# EAGLE design MWElement5x15 (EAGLE 8.6.0)
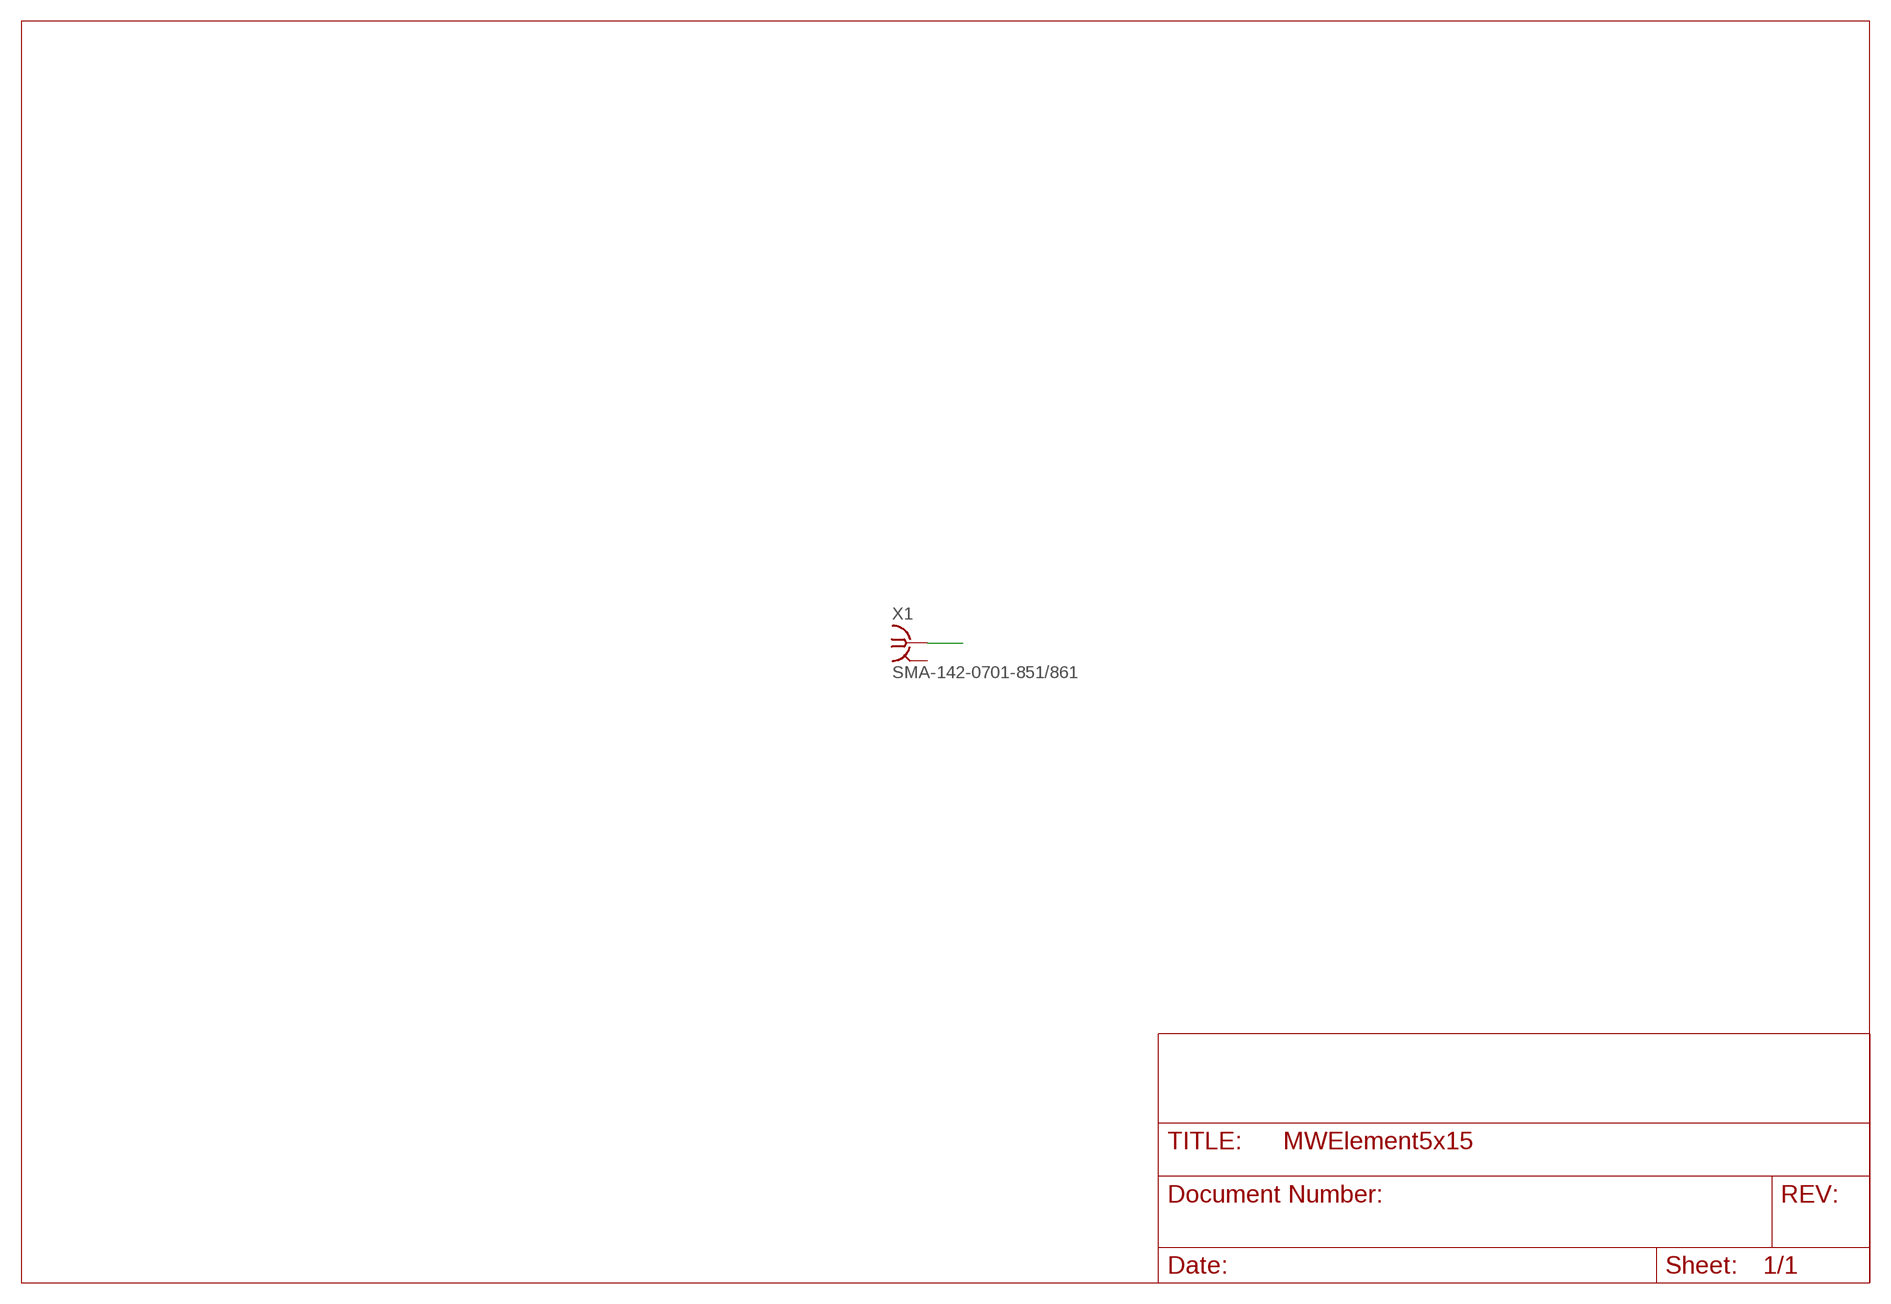
[diagram p0: schematic, sheet 1]

## Parts
X1  SMA-142-0701-851/861  [J502-ND-142-0701-851/861]

## Nets
P: X1.1
Unconnected: X1.G@1 X1.G@2 X1.G@3 X1.G@4

## Library data of the parts
X1 = con-coax:SMA-: SMA 50 Ohm End Launch Jack Receptacle - Round Contact Johnson Components Source: www.johnsoncomponents.com .. J502-ND.pdf; MF: JOHNSON COMPONENTS; MPN: 142-0701-851; OC_FARNELL: 1019325; OC_NEWARK: 99F6798

## Board
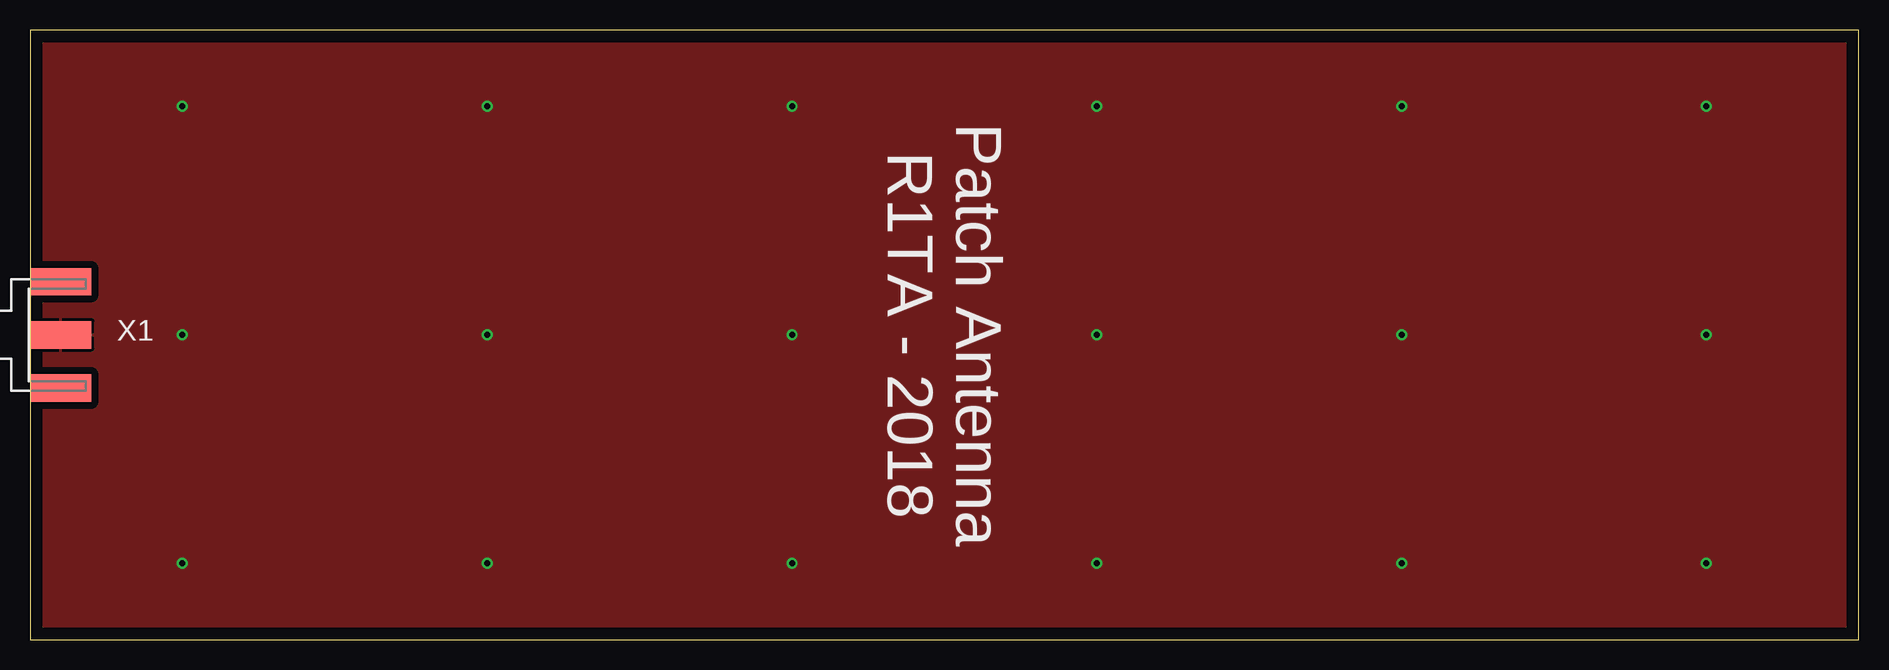
[diagram p1: board, top side]
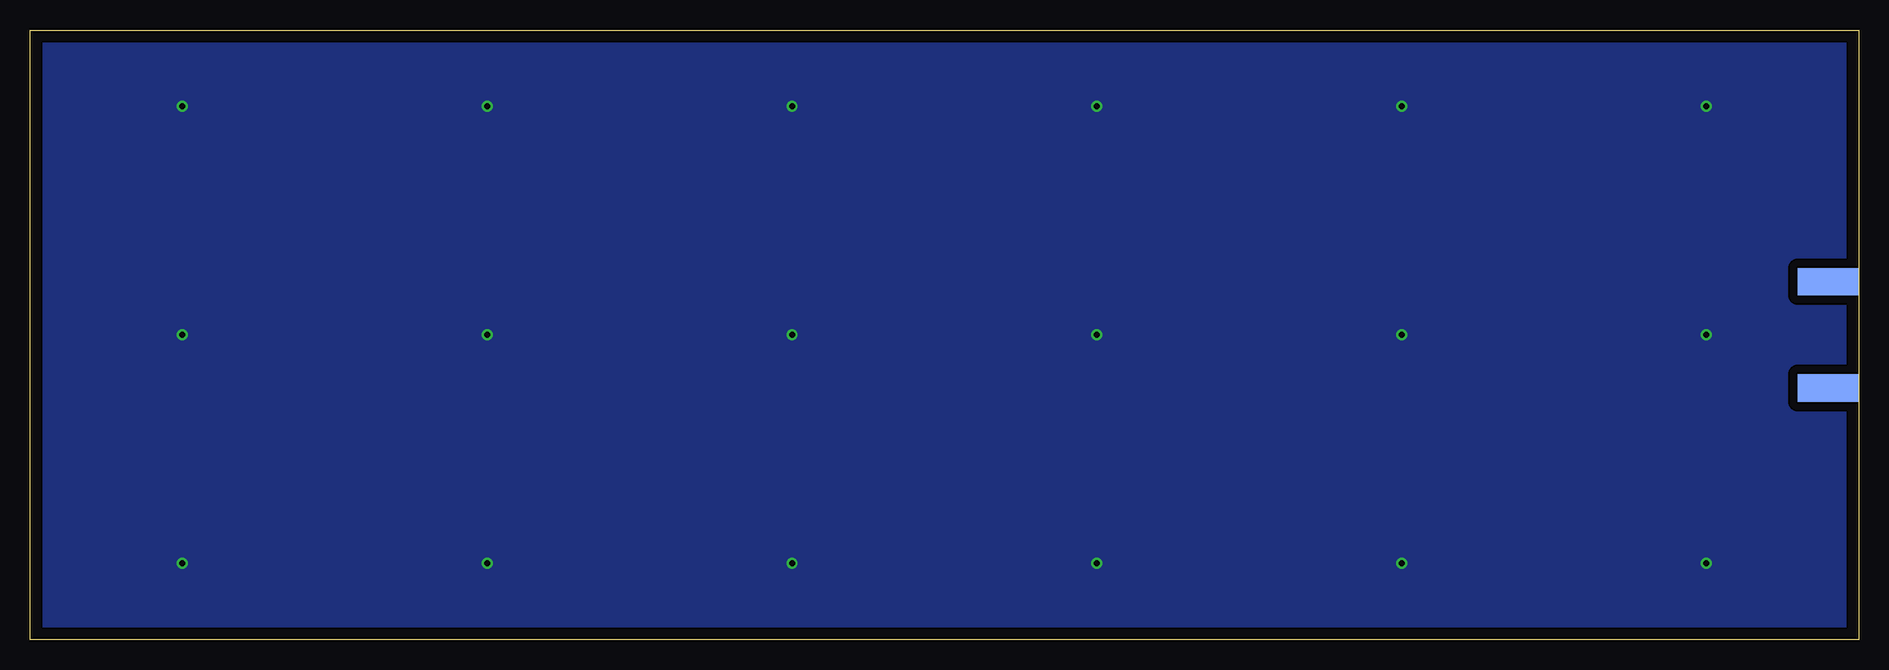
[diagram p2: board, bottom side, seen from below]

Size 152.4 x 50.8 mm. Coordinates in mm from the lower left corner, seen from the top.
Outline: 0,0 152.4,0 152.4,50.8 0,50.8 0,0
Copper layers (1*16): Top 0.035mm / dielectric 1.5mm / Bottom 0.035mm
Design rules "default": minimum track width 6mil, minimum drill 0.35mm, track to track 6mil, track to pad 6mil, pad to pad 6mil, via to via 6mil, smd to smd 6mil, copper to edge 40mil, drill to drill 6mil, minimum pad ring 10mil, minimum via ring 8mil, stop-mask expansion 4mil, vias tented up to drill 0mil, thermal gap 10mil

### Footprints (pad centres in the part's own frame; a part is rotated, then mirrored left to right if it is on the bottom)
J502-ND-142-0701-851/861 = smd 5.08 x 2.286: 1 2.565,0; G@1 2.565,4.42; G@2 2.565,-4.42 | smd 5.08 x 2.286 bottom: G@3 2.565,4.42; G@4 2.565,-4.42

### Placement (x,y rotation side)
X1  0,25.4 0 top

### Tracks (layer width: path | path; a pad name or v marks a point on that pad's centre or on a via)
P  (via drill 0.5)
  other vias: 12.7,44.45 38.1,44.45 63.5,44.45 88.9,44.45 114.3,44.45 139.7,44.45 12.7,6.35 38.1,6.35 63.5,6.35 88.9,6.35 114.3,6.35 139.7,6.35 12.7,25.4 38.1,25.4 63.5,25.4 88.9,25.4 114.3,25.4 139.7,25.4
  pour Top (isolate 0.61): 0,0 0,50.8 152.4,50.8 152.4,0
  pour Bottom (isolate 0.813): 0,0 0,50.8 152.4,50.8 152.4,0

### Text on the board
tNames: Patch Antenna / R1TA - 2018